# Altium schematic sheet 2EDGB-5.08-02P.schdoc
size 41 x 30 mm
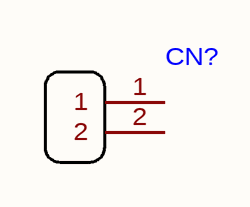
[diagram p0: 2EDGB-5.08-02P.schdoc]

## Parts
CN?  (no value)  [2EDGB-5.08-02P-14-00A]

## Nets

Not connected (* = marked no-connect by the designer): CN? 1 2

## Library data of the parts
CN? = 2EDGB-5.08-02P-14-00A(H)